# EAGLE schematic TfTrackpad (EAGLE 9.6.2)
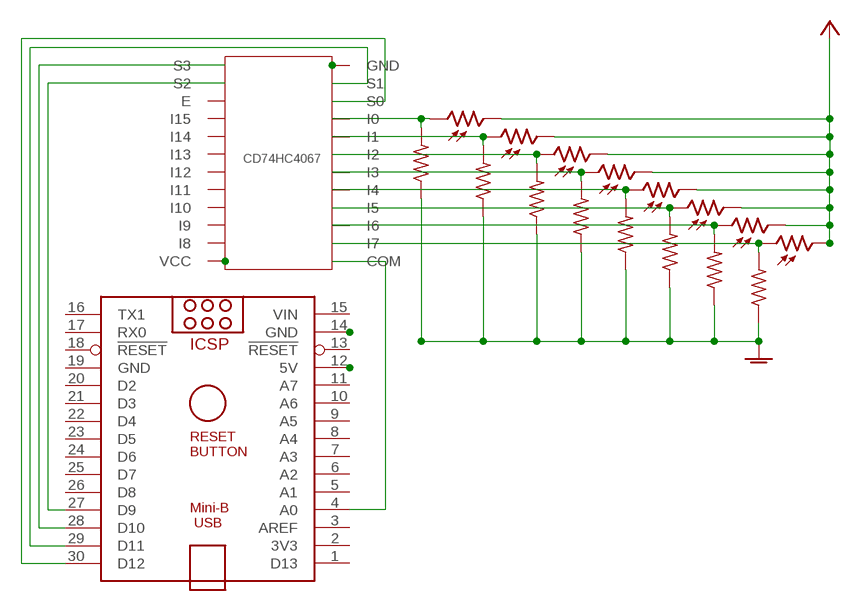
[diagram p0: schematic, sheet 1]

## Parts
ARDUINO_NANO1  ARDUINO_NANO  [ARDUINO_NANO]
CD74HC4067  CD74HC4067  CD74HC4067SM96  [LP24SSOP]
PH1  B1060_23  [TO-8_B10]
PH2  B1060_23  [TO-8_B10]
PH3  B1060_23  [TO-8_B10]
PH4  B1060_23  [TO-8_B10]
PH5  B1060_23  [TO-8_B10]
PH6  B1060_23  [TO-8_B10]
PH7  B1060_23  [TO-8_B10]
PH8  B1060_23  [TO-8_B10]
R1  R-US_0204/5  [0204/5]
R2  R-US_0204/5  [0204/5]
R3  R-US_0204/5  [0204/5]
R4  R-US_0204/5  [0204/5]
R5  R-US_0204/5  [0204/5]
R6  R-US_0204/5  [0204/5]
R7  R-US_0204/5  [0204/5]
R8  R-US_0204/5  [0204/5]

## Nets
AGND: R1.1 R2.1 R3.1 R4.1 R5.1 R6.1 R7.1 R8.1
N$1: CD74HC4067.I0 PH1.1 R1.2
N$2: CD74HC4067.I1 PH2.1 R2.2
N$3: CD74HC4067.I2 PH3.1 R3.2
N$4: CD74HC4067.I3 PH4.1 R4.2
N$5: CD74HC4067.I4 PH5.1 R5.2
N$6: CD74HC4067.I5 PH6.1 R6.2
N$7: CD74HC4067.I6 PH7.1 R7.2
N$8: CD74HC4067.I7 PH8.1 R8.2
N$9: ARDUINO_NANO1.4(A0) CD74HC4067.COM
N$10: ARDUINO_NANO1.27(D9) CD74HC4067.S2
N$11: ARDUINO_NANO1.28(D10) CD74HC4067.S3
N$12: ARDUINO_NANO1.29(D11) CD74HC4067.S1
N$13: ARDUINO_NANO1.30(D12) CD74HC4067.S0
N$14: CD74HC4067.GND
N$15: CD74HC4067.VCC
N$16: ARDUINO_NANO1.14(GND)
N$17: ARDUINO_NANO1.12(5V)
VCC: PH1.2 PH2.2 PH3.2 PH4.2 PH5.2 PH6.2 PH7.2 PH8.2
Unconnected: ARDUINO_NANO1.1(D13) ARDUINO_NANO1.2(3V3) ARDUINO_NANO1.3(AREF) ARDUINO_NANO1.5(A1) ARDUINO_NANO1.6(A2) ARDUINO_NANO1.7(A3) ARDUINO_NANO1.8(A4) ARDUINO_NANO1.9(A5) ARDUINO_NANO1.10(A6) ARDUINO_NANO1.11(A7) ARDUINO_NANO1.13(!RESET) ARDUINO_NANO1.16(TX1) ARDUINO_NANO1.17(RX0) ARDUINO_NANO1.18(!RESET) ARDUINO_NANO1.20(D2) ARDUINO_NANO1.21(D3) ARDUINO_NANO1.22(D4) ARDUINO_NANO1.23(D5) ARDUINO_NANO1.24(D6) ARDUINO_NANO1.25(D7) ARDUINO_NANO1.26(D8) CD74HC4067.E CD74HC4067.I8 CD74HC4067.I9 CD74HC4067.I10 CD74HC4067.I11 CD74HC4067.I12 CD74HC4067.I13 CD74HC4067.I14 CD74HC4067.I15

## Power pins joined to a net without a drawn wire
GND: ARDUINO_NANO1.19(GND)
VIN: ARDUINO_NANO1.15(VIN)

## Library data of the parts
ARDUINO_NANO1 = ArduinoNanoV30:ARDUINO_NANO: Arduino Nano V3.0 Overview: The Arduino Nano is a small, complete, and breadboard-friendly board based on the ATmega328 (Arduino Nano 3.x) or ATmega168 (Arduino Nano 2.x). It has more or less the same functionality of the Arduino Duemilanove, but in a different package. It lacks only a DC power jack, and works with a Mini-B USB cable instead of a standard one. The Nano was designed and is being produced by Gravitech. Specifications: Microcontroller Atmel ATmega168 or ATmega328 Operating Voltage (logic level) 5 V Input Voltage (recommended) 7-12 V Input Voltage (limits) 6-20 V Digital I/O Pins 14 (of which 6 provide PWM output) Analog Input Pins 8 DC Current per I/O Pin 40 mA Flash Memory 16 KB (ATmega168) or 32 KB (ATmega328) of which 2 KB used by bootloader SRAM 1 KB (ATmega168) or 2 KB (ATmega328) EEPROM 512 bytes (ATmega168) or 1 KB (ATmega328) Clock Speed 16 MHz Dimensions 0.73" x 1.70" Length 45 mm Width 18 mm Weigth 5 g Power: The Arduino Nano can be powered via the Mini-B USB connection, 6-20V unregulated external power supply (pin 30), or 5V regulated external power supply (pin 27). The power source is automatically selected to the highest voltage source. Memory: The ATmega168 has 16 KB of flash memory for storing code (of which 2 KB is used for the bootloader); the ATmega328 has 32 KB, (also with 2 KB used for the bootloader). The ATmega168 has 1 KB of SRAM and 512 bytes of EEPROM (which can be read and written with the EEPROM library); the ATmega328 has 2 KB of SRAM and 1 KB of EEPROM. Input and Output: Each of the 14 digital pins on the Nano can be used as an input or output, using pinMode(), digitalWrite(), and digitalRead() functions. They operate at 5 volts. Each pin can provide or receive a maximum of 40 mA and has an internal pull-up resistor (disconnected by default) of 20-50 kOhms. In addition, some pins have specialized functions. Visit Arduino - ArduinoBoardNano <https://www.arduino.cc/en/Main/ArduinoBoardNano>
CD74HC4067 = CD74HC4067 MUX_DEMUX:CD74HC4067: by miky_police Italy
PH1-PH8 = photo-elements:?1060*: Sensor Street Light control Source: http://optoelectronics.perkinelmer.com/content/Datasheets/DTS_PhotocellsB1060.pdf
R1-R8 = adafruit:R-US_: RESISTOR, American symbol